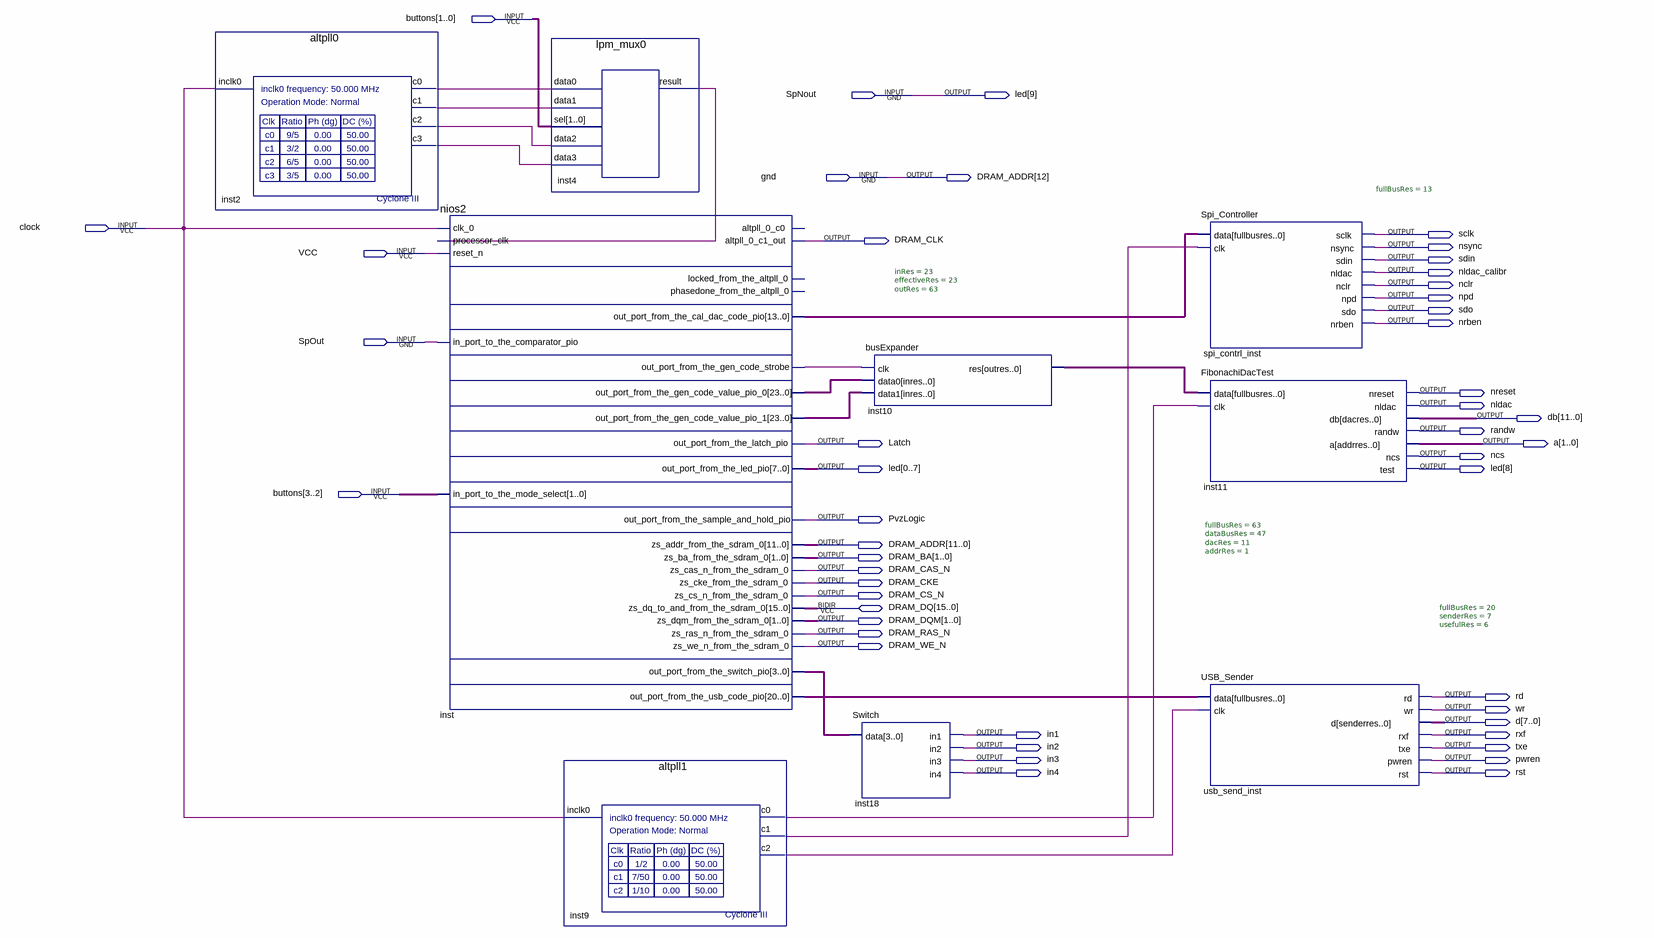
[diagram p0: schematic sheet]
// Quartus schematic ProcLed.bdf as structural Verilog: 9 symbols, 48 pins
module ProcLed (
  input  [3:0] buttons,
  input  SpNout,
  input  gnd,
  input  clock,
  input  VCC,
  input  SpOut,
  inout  [15:0] DRAM_DQ,
  output [0:9] led,
  output [12:0] DRAM_ADDR,
  output sclk,
  output DRAM_CLK,
  output nsync,
  output sdin,
  output nldac_calibr,
  output nclr,
  output npd,
  output sdo,
  output nrben,
  output nreset,
  output nldac,
  output [11:0] db,
  output randw,
  output Latch,
  output [1:0] a,
  output ncs,
  output PvzLogic,
  output [1:0] DRAM_BA,
  output DRAM_CAS_N,
  output DRAM_CKE,
  output DRAM_CS_N,
  output [1:0] DRAM_DQM,
  output DRAM_RAS_N,
  output DRAM_WE_N,
  output rd,
  output wr,
  output [7:0] d,
  output in1,
  output rxf,
  output in2,
  output txe,
  output in3,
  output pwren,
  output in4,
  output rst
);

  wire inst2_c0, inst2_c1, inst2_c2, inst2_c3, inst4_result, inst9_c0, inst9_c1, inst9_c2,
       inst_out_port_from_the_gen_code_strobe;
  wire [3:0] inst_out_port_from_the_switch_pio;
  wire [13:0] inst_out_port_from_the_cal_dac_code_pio;
  wire [20:0] inst_out_port_from_the_usb_code_pio;
  wire [23:0] inst_out_port_from_the_gen_code_value_pio_0, inst_out_port_from_the_gen_code_value_pio_1;
  wire [63:0] inst10_res;

  altpll0 inst2 (.inclk0(clock), .c0(inst2_c0), .c1(inst2_c1), .c2(inst2_c2), .c3(inst2_c3));
  nios2 inst (
    .clk_0(clock), .processor_clk(inst4_result), .reset_n(VCC), .in_port_to_the_comparator_pio(SpOut),
    .in_port_to_the_mode_select(buttons[3:2]), .altpll_0_c1_out(DRAM_CLK),
    .out_port_from_the_cal_dac_code_pio(inst_out_port_from_the_cal_dac_code_pio),
    .out_port_from_the_gen_code_strobe(inst_out_port_from_the_gen_code_strobe),
    .out_port_from_the_gen_code_value_pio_0(inst_out_port_from_the_gen_code_value_pio_0),
    .out_port_from_the_gen_code_value_pio_1(inst_out_port_from_the_gen_code_value_pio_1),
    .out_port_from_the_latch_pio(Latch), .out_port_from_the_led_pio(led[0:7]),
    .out_port_from_the_sample_and_hold_pio(PvzLogic), .zs_addr_from_the_sdram_0(DRAM_ADDR[11:0]),
    .zs_ba_from_the_sdram_0(DRAM_BA), .zs_cas_n_from_the_sdram_0(DRAM_CAS_N),
    .zs_cke_from_the_sdram_0(DRAM_CKE), .zs_cs_n_from_the_sdram_0(DRAM_CS_N),
    .zs_dqm_from_the_sdram_0(DRAM_DQM), .zs_ras_n_from_the_sdram_0(DRAM_RAS_N),
    .zs_we_n_from_the_sdram_0(DRAM_WE_N), .out_port_from_the_switch_pio(inst_out_port_from_the_switch_pio),
    .out_port_from_the_usb_code_pio(inst_out_port_from_the_usb_code_pio),
    .zs_dq_to_and_from_the_sdram_0(DRAM_DQ));  // open: altpll_0_c0, locked_from_the_altpll_0, phasedone_from_the_altpll_0
  lpm_mux0 inst4 (
    .data0(inst2_c0), .data1(inst2_c1), .sel(buttons[1:0]), .data2(inst2_c2), .data3(inst2_c3),
    .result(inst4_result));
  altpll1 inst9 (.inclk0(clock), .c0(inst9_c0), .c1(inst9_c1), .c2(inst9_c2));
  busExpander #(.inRes(23), .effectiveRes(23), .outRes(63)) inst10 (
    .clk(inst_out_port_from_the_gen_code_strobe), .data0(inst_out_port_from_the_gen_code_value_pio_0),
    .data1(inst_out_port_from_the_gen_code_value_pio_1), .res(inst10_res));
  Switch inst18 (.data(inst_out_port_from_the_switch_pio), .in1(in1), .in2(in2), .in3(in3), .in4(in4));
  Spi_Controller #(.fullBusRes(13)) spi_contrl_inst (
    .data(inst_out_port_from_the_cal_dac_code_pio), .clk(inst9_c1), .sclk(sclk), .nsync(nsync), .sdin(sdin),
    .nldac(nldac_calibr), .nclr(nclr), .npd(npd), .sdo(sdo), .nrben(nrben));
  FibonachiDacTest #(.fullBusRes(63), .dataBusRes(47), .dacRes(11), .addrRes(1)) inst11 (
    .data(inst10_res), .clk(inst9_c0), .nreset(nreset), .nldac(nldac), .db(db), .randw(randw), .a(a),
    .ncs(ncs), .test(led[8]));
  USB_Sender #(.fullBusRes(20), .senderRes(7), .usefulRes(6)) usb_send_inst (
    .data(inst_out_port_from_the_usb_code_pio), .clk(inst9_c2), .rd(rd), .wr(wr), .d(d), .rxf(rxf),
    .txe(txe), .pwren(pwren), .rst(rst));

  assign DRAM_ADDR[12] = gnd;
  assign led[9] = SpNout;
endmodule
